# Altium schematic sheet flash.SchDoc
size A
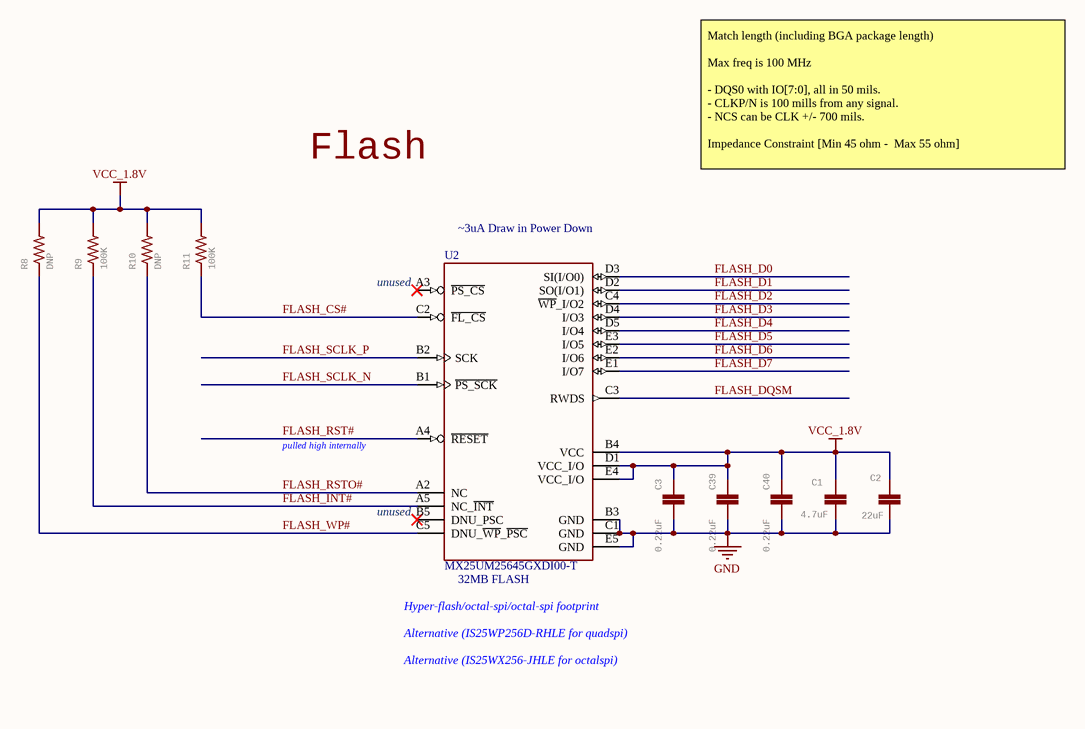
[diagram p0: flash.SchDoc]

## Parts
C1  4.7uF  [0402-CAP]
C2  22uF  [0805]
C3  0.22uF  [C0201]
C39  0.22uF  [C0201]
C40  0.22uF  [C0201]
R8  DNP  [R0201]
R9  100K  [R0201]
R10  DNP  [R0201]
R11  100K  [R0201]
U2  MX25UM25645GXDI00-T  [24-TBGA]

## Nets
GND: C1.1 C2.1 C3.2 C39.2 C40.2 U2.B3(GND) U2.C1(GND) U2.E5(GND)
VCC_1.8V: C1.2 C2.2 C3.1 C39.1 C40.1 R8.2 R9.2 R10.2 R11.2 U2.B4(VCC) U2.D1(VCC_I/O) U2.E4(VCC_I/O)
FLASH_CS#: R11.1 U2.C2(~{FL_CS})
FLASH_D0: U2.D3(SI(I/O0))
FLASH_D1: U2.D2(SO(I/O1))
FLASH_D2: U2.C4(~{WP}_I/O2)
FLASH_D3: U2.D4(I/O3)
FLASH_D4: U2.D5(I/O4)
FLASH_D5: U2.E3(I/O5)
FLASH_D6: U2.E2(I/O6)
FLASH_D7: U2.E1(I/O7)
FLASH_DQSM: U2.C3(RWDS)
FLASH_INT#: R9.1 U2.A5(NC_~{INT})
FLASH_RST#: U2.A4(~{RESET})
FLASH_RSTO#: R10.1 U2.A2(NC)
FLASH_SCLK_N: U2.B1(~{PS_SCK})
FLASH_SCLK_P: U2.B2(SCK)
FLASH_WP#: R8.1 U2.C5(DNU_~{WP}_~{PSC})

Not connected (* = marked no-connect by the designer): U2 A3(~{PS_CS})* B5(DNU_PSC)*

## Notes on the sheet
- Flash
- Match length (including BGA package length)
  Max freq is 100 MHz
  - DQS0 with IO[7:0], all in 50 mils.
  - CLKP/N is 100 mills from any signal.
  - NCS can be CLK +/- 700 mils.
  Impedance Constraint [Min 45 ohm -  Max 55 ohm]
- (near U2) ~3uA Draw in Power Down
- (near U2) unused
- pulled high internally
- Hyper-flash/octal-spi/octal-spi footprint
- (near U2) 32MB FLASH
- Alternative (IS25WP256D-RHLE for quadspi)
- Alternative (IS25WX256-JHLE for octalspi)

## Library data of the parts
C1 = CAP0402-CAP: CapacitorStandard 0603 ceramic capacitor, and 0.1" leaded capacitor.; MPN: JMK105BBJ475MV-F; GateName_1: G$1; SymbolName_1: CAP; DeviceName: 0402-CAP; LibraryName: sfe; DeviceSetName: CAP; Part Number: JMK105BBJ475MV-F
C2 = 22UF-0805-6.3V-20%: 22ÂµF ceramic capacitors    A capacitor is a passive two-terminal electrical component used to store electrical energy temporarily in an electric field.; MPN: CL21A226MQQNNNE; GateName_1: G$1; SymbolName_1: CAP; PROD_ID: CAP-08402; DeviceName: -0805-6.3V-20%; LibraryName: SparkFun-Capacitors; DeviceSetName: 22UF; Part Number: CL21A226MQQNNNE
C3 C39 C40 = C-EUC0201: CAPACITOR, European symbol; MPN: GRM033R60J224ME15D; GateName_1: G$1; SymbolName_1: C-EU; POPULARITY: 0; DeviceName: C0201; LibraryName: rcl; DeviceSetName: C-EU; SPICEPREFIX: C; Part Number: GRM033R60J224ME15D
R8 R10 = RESISTOR0402-RES: GateName_1: G$1; SymbolName_1: RESISTOR; LibraryName: sfe; DeviceSetName: RESISTOR; MPN: DNP; Part Number: DNP
R9 R11 = RESISTOR0402-RES: MPN: RMCF0201FT100K; GateName_1: G$1; SymbolName_1: RESISTOR; LibraryName: sfe; DeviceSetName: RESISTOR; Part Number: RMCF0201FT100K
U2 = IS25WX256-JHLE: IC, Flash,32MB x 8, Octal SPI, Ind Temp, 1.8V,24-BGA; MF: ISSI; Part Number: MX25UM25645GXDI00-T; MPN: MX25UM25645GXDI00-T